# EasyEDA Pro project 407vet6_imu_car.eprj, board PCB1
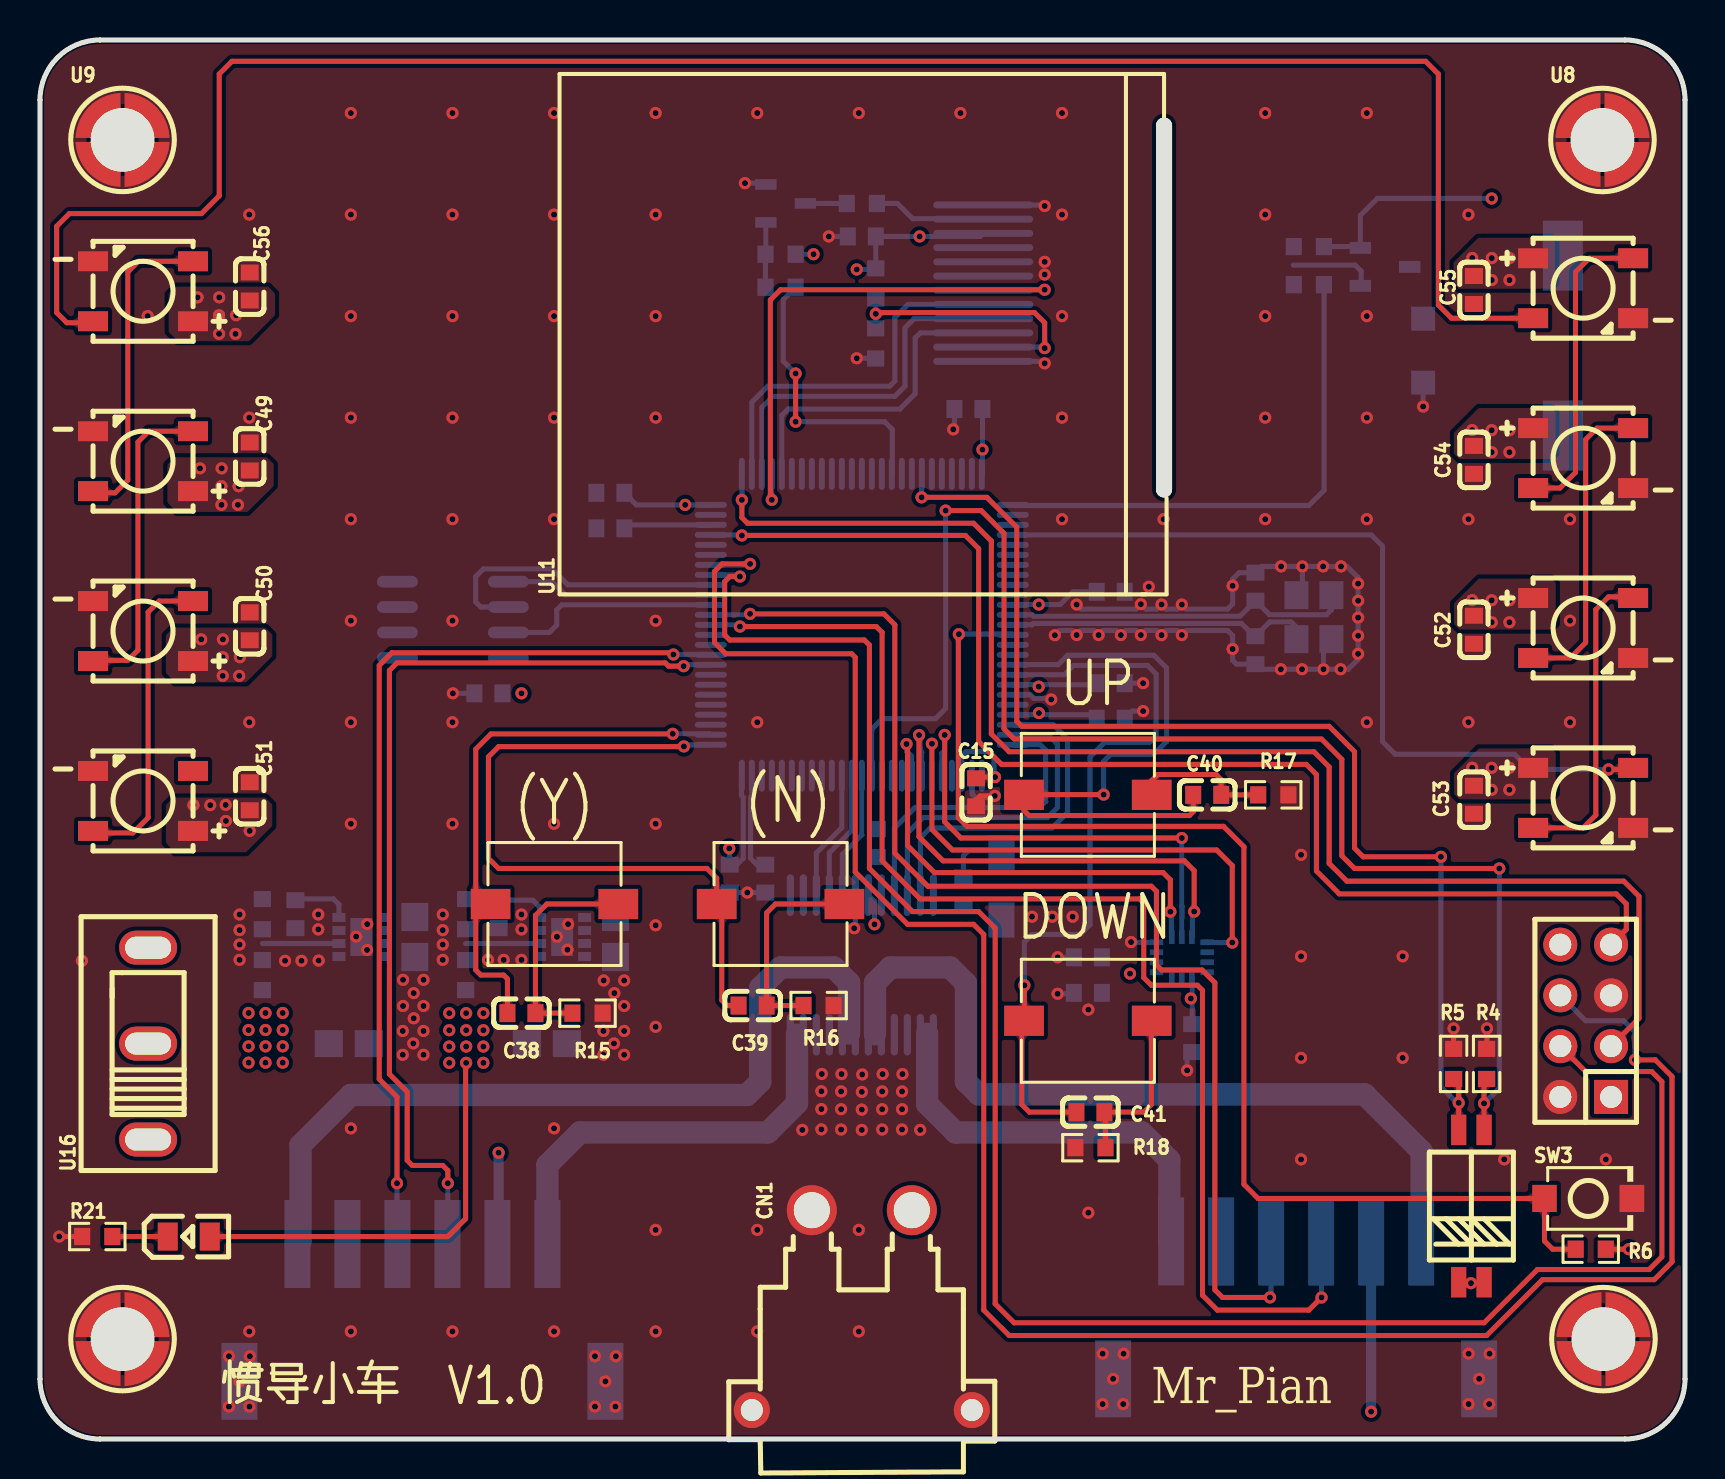
[diagram p2: board, top side]
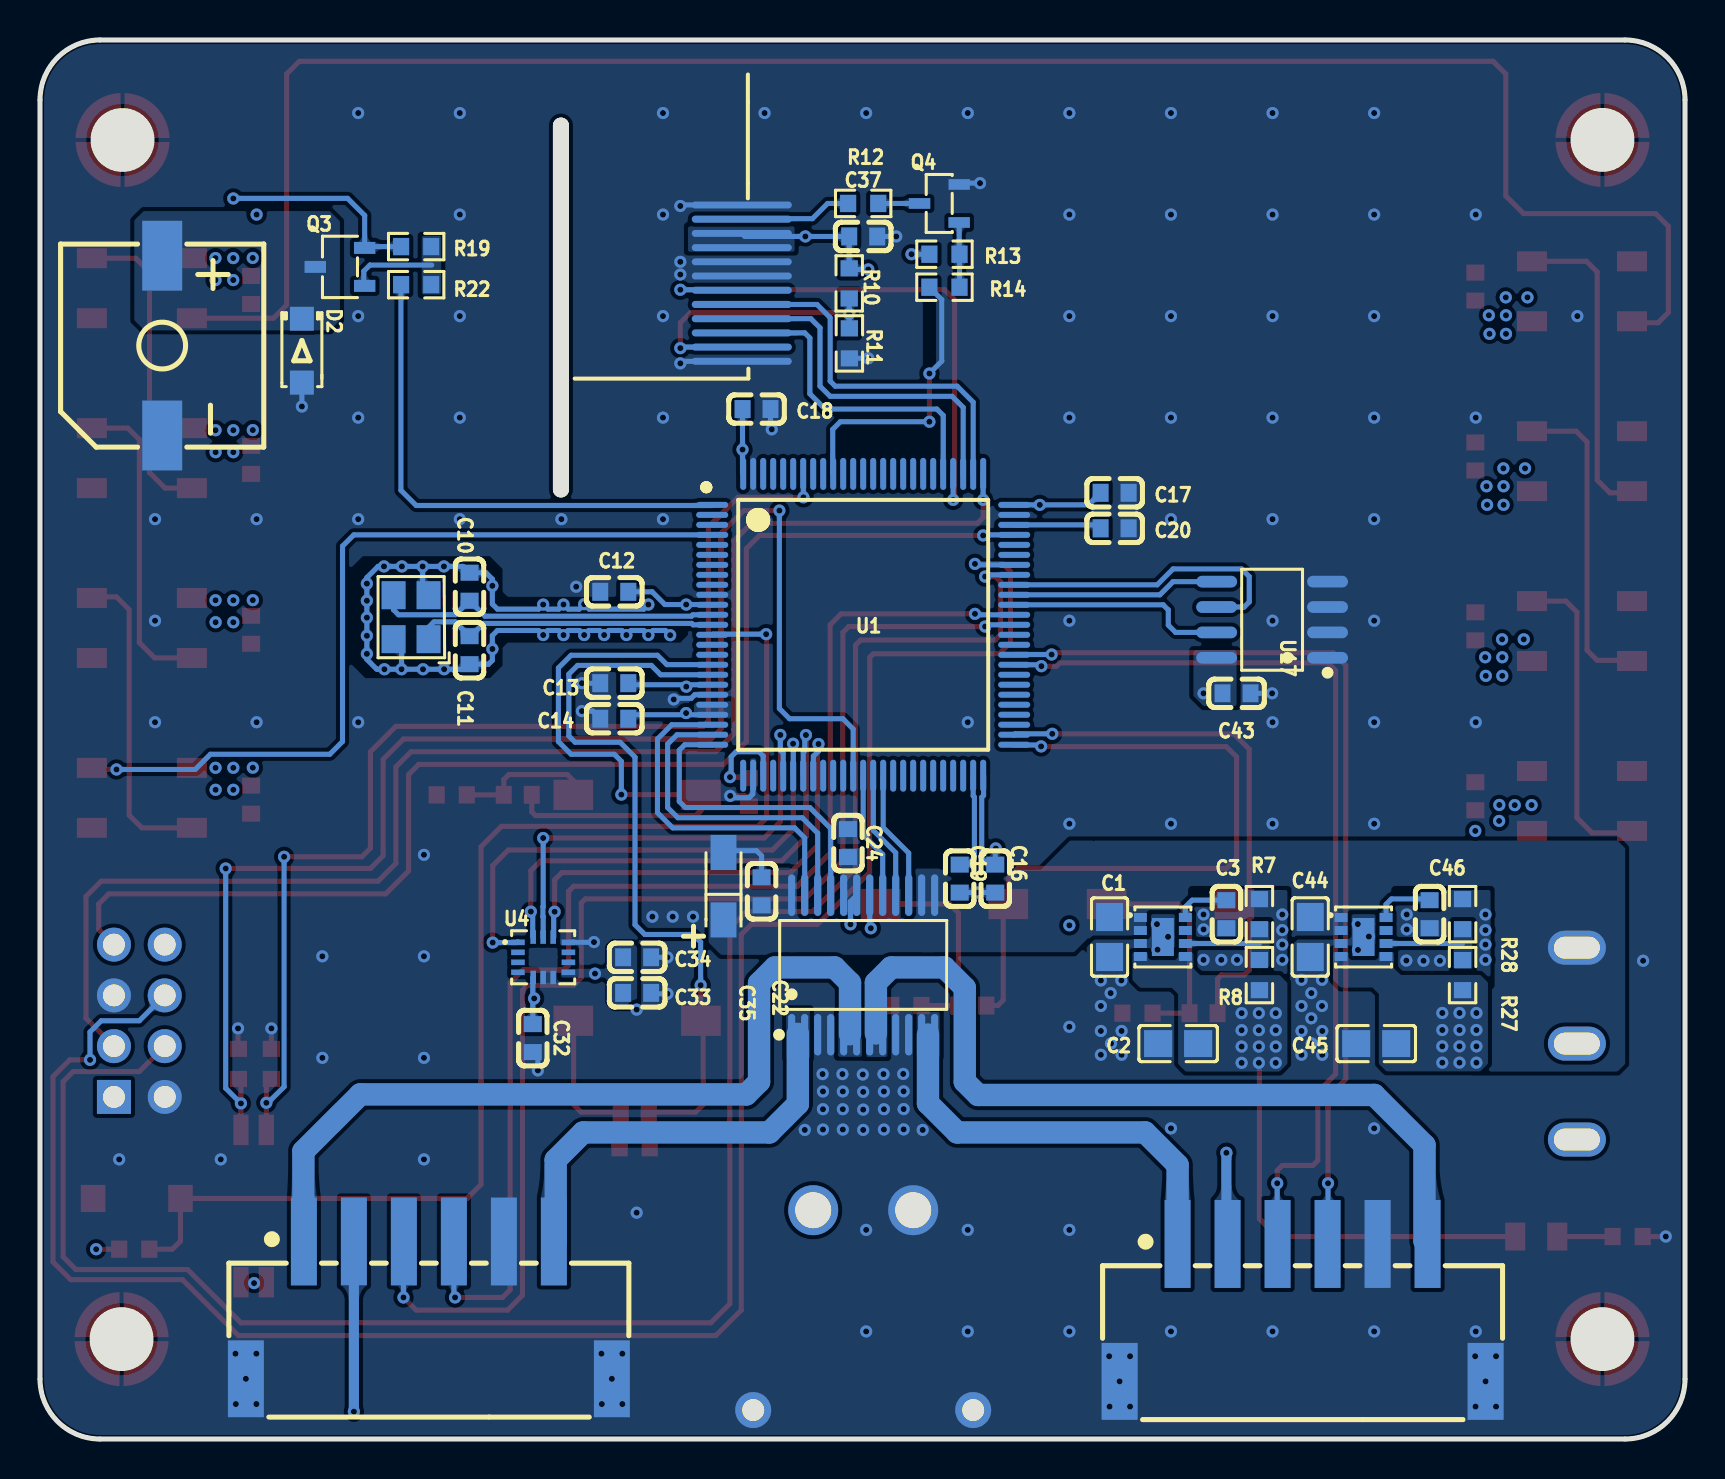
[diagram p3: board, bottom side, seen from below]

Outline 82.26 x 70 mm; copper layers: Top Layer, GND, PWR, Bottom Layer. Coordinates in mm from the lower left corner of the outline.
Outline path: 0,67 0,3 arc(0.88,0.88) 3,0 79.26,0 arc(81.38,0.88) 82.26,3 82.26,67 arc(81.38,69.12) 79.26,70 3,70 arc(0.88,69.12) 0,67
Stack: Top Layer 0.035mm 外层铜厚1oz / Dielectric1 0.2104mm 7628 RC49% 8.6mil / GND 0.0152mm 内层铜厚 / Dielectric2 1.065mm 1.1mm H/HOZ Copper / PWR 0.0152mm 内层铜厚 / Dielectric3 0.2104mm 7628 RC49% 8.6mil / Bottom Layer 0.035mm 外层铜厚1oz

## Design rules (mm)
template: 自定义配置
spacing copperThickness1oz (default): track to track 0.102, other pairs 0 to 0.3
spacing copperThickness2oz: track to track 0.203, other pairs 0.152 to 0.3
track width copperThickness1oz (default): min 0.127, default 0.254, max 2.54
track width copperThickness2oz: min 0.203, default 0.254, max 2.54
differential pair differentialPair (default): width min 0.127, default 0.254, max 2.54; gap min 0.152, default 0.152
via viaSize (default): diameter min 0.5, default 0.61, max 10; hole min 0.3, default 0.305, max 6.3
net GND uses innerPlane1

## Placement (name value [footprint] x y rotation side)
BUZZER1  2.7kHz  [BUZ-SMD_L9.6-W9.6-LS10.0-R]  76.14 54.71 90 bottom
C1  10uF  [C0805]  28.77 25.12 270 bottom
C2  22uF  [C0805]  25.34 19.78 180 bottom
C3  3.3nF  [C0603]  22.93 26.26 270 bottom
C10  20pF  [C0603]  60.78 42.64 270 bottom
C11  20pF  [C0603]  60.78 39.47 270 bottom
C12  100nF  [C0603]  53.54 42.39 180 bottom
C13  100nF  [C0603]  53.54 37.82 180 bottom
C14  100nF  [C0603]  53.54 36.04 180 bottom
C15  100nF  [C0603]  46.81 32.36 90 top
C16  100nF  [C0603]  34.49 28.04 90 bottom
C17  100nF  [C0603]  28.52 47.34 0 bottom
C18  100nF  [C0603]  46.43 51.53 0 bottom
C19  2.2uF  [C0603]  36.27 28.04 90 bottom
C20  2.2uF  [C0603]  28.52 45.56 0 bottom
C22  100nF  [C0603]  46.17 27.4 90 bottom
C24  100nF  [C0603]  41.86 29.82 90 bottom
C32  10nF  [C0603]  57.61 20.06 90 bottom
C33  2.2uF  [C0603]  52.4 22.32 0 bottom
C34  100nF  [C0603]  52.4 24.1 0 bottom
C35  10uF  [CAP-SMD_L3.2-W1.6-RD-C7171]  48.08 27.66 90 bottom
C37  100nF  [C0603]  41.09 60.17 180 bottom
C38  100nF  [C0603]  24.08 21.31 180 top
C39  100nF  [C0603]  35.63 21.69 180 top
C40  100nF  [C0603]  58.36 32.23 180 top
C41  100nF  [C0603]  52.52 16.35 180 top
C43  100nF  [C0603]  22.42 37.31 180 bottom
C44  10uF  [C0805]  18.74 25.12 270 bottom
C45  22uF  [C0805]  15.44 19.78 180 bottom
C46  3.3nF  [C0603]  12.77 26.26 270 bottom
C49  100nF  [C0603]  10.49 49.16 90 top
C50  100nF  [C0603]  10.49 40.66 90 top
C51  100nF  [C0603]  10.49 32.16 90 top
C52  100nF  [C0603]  71.7 40.49 270 top
C53  100nF  [C0603]  71.7 31.99 270 top
C54  100nF  [C0603]  71.7 48.99 270 top
C55  100nF  [C0603]  71.7 57.49 270 top
C56  100nF  [C0603]  10.49 57.66 90 top
CN1  XT30PW-M30.G.Y  [CONN-TH_XT30PW-M]  41.09 6.45 0 top
CN2  HCZZ0021-6  [CONN-SMD_HCZZ0021-6]  19.12 6.32 180 bottom
CN3  HCZZ0021-6  [CONN-SMD_HCZZ0021-6]  62.81 6.45 180 bottom
D2  1N4007 A7  [SOD-123FL_L2.8-W1.8-LS3.7-RD]  69.16 54.45 270 bottom
H1  PZ254V-12-8P  [HDR-TH_8P-P2.54-V-M-R2-C4-S2.54]  77.29 20.93 90 top
LED1  NCD0805R1  [LED0805-R-RD]  7.44 10.13 0 top
LED2  XL-5050RGBC-WS2812B  [LED-SMD_4P-L5.0-W5.0-BL_XL-5050RGBC]  77.16 32.08 270 top
LED3  XL-5050RGBC-WS2812B  [LED-SMD_4P-L5.0-W5.0-BL_XL-5050RGBC]  77.16 40.58 270 top
LED4  XL-5050RGBC-WS2812B  [LED-SMD_4P-L5.0-W5.0-BL_XL-5050RGBC]  77.16 49.08 270 top
LED5  XL-5050RGBC-WS2812B  [LED-SMD_4P-L5.0-W5.0-BL_XL-5050RGBC]  77.16 57.58 270 top
LED6  XL-5050RGBC-WS2812B  [LED-SMD_4P-L5.0-W5.0-BL_XL-5050RGBC]  5.15 57.43 90 top
LED7  XL-5050RGBC-WS2812B  [LED-SMD_4P-L5.0-W5.0-BL_XL-5050RGBC]  5.15 48.93 90 top
LED8  XL-5050RGBC-WS2812B  [LED-SMD_4P-L5.0-W5.0-BL_XL-5050RGBC]  5.15 40.43 90 top
LED9  XL-5050RGBC-WS2812B  [LED-SMD_4P-L5.0-W5.0-BL_XL-5050RGBC]  5.15 31.93 90 top
Q3  S8550  [SOT-23-3_L2.9-W1.6-P1.90-LS2.8-BR]  67.26 58.65 180 bottom
Q4  S8050  [SOT-23-3_L2.9-W1.3-P1.90-LS2.3-BR]  37.28 61.82 180 bottom
R4  10kΩ  [R0603]  72.33 18.77 90 top
R5  10kΩ  [R0603]  70.68 18.77 90 top
R6  10kΩ  [R0603]  77.54 9.5 0 top
R7  24kΩ  [R0603]  21.28 26.26 90 bottom
R8  75kΩ  [R0603]  21.28 23.21 90 bottom
R10  10kΩ  [R0603]  41.79 57.82 90 bottom
R11  0Ω  [R0603]  41.78 54.82 90 bottom
R12  10Ω  [R0603]  41.09 61.82 0 bottom
R13  10kΩ  [R0603]  37.03 59.28 180 bottom
R14  1kΩ  [R0603]  37.03 57.63 180 bottom
R15  10kΩ  [R0603]  27.38 21.31 180 top
R16  10kΩ  [R0603]  38.93 21.69 180 top
R17  10kΩ  [R0603]  61.67 32.23 180 top
R18  10kΩ  [R0603]  52.52 14.58 0 top
R19  10kΩ  [R0603]  63.45 59.66 180 bottom
R21  1kΩ  [R0603]  2.87 10.13 0 top
R22  1kΩ  [R0603]  63.45 57.76 180 bottom
R27  52.3kΩ  [R0603]  11.12 23.21 90 bottom
R28  10kΩ  [R0603]  11.12 26.26 90 bottom
SW2  DSHP02TSGER  [SW-SMD_DSHP02TSGER]  71.57 11.66 0 top
SW3  TS-1088-AR02016  [SW-SMD_L3.9-W3.0-P4.45]  77.42 12.04 0 top
U1  STM32F407VGT6  [LQFP-100_L14.0-W14.0-P0.50-LS16.0-BL]  41.09 40.74 270 bottom
U2  TPS82130SILR  [USIP-8_L3.0-W2.8-P0.65-TL-EP]  26.11 25.12 180 bottom
U3  TB6612FNG(O,C,8,EL  [SSOP-24_L8.4-W5.8-P0.65-LS7.8-BL]  41.09 23.72 180 bottom
U4  ICM-42688-P  [LGA-14_L3.0-W2.5-P0.50-TL]  57.09 24.1 180 bottom
U6  铜柱M3*5+6  [SMD_BD4.2-L4.7-W4.7-D3.0]  78.18 5 0 top
U7  铜柱M3*5+6  [SMD_BD4.2-L4.7-W4.7-D3.0]  4.13 5 0 top
U8  铜柱M3*5+6  [SMD_BD4.2-L4.7-W4.7-D3.0]  78.13 65 0 top
U9  铜柱M3*5+6  [SMD_BD4.2-L4.7-W4.7-D3.0]  4.13 65 0 top
U11  ST7789V-12PIN 1.3寸LCD  [ST7789V-12PIN]  56.33 42.26 90 top
U12  TS-1199A26050  [SW-SMD_L6.0-W6.0-LS6.6]  25.73 26.77 0 top
U13  TS-1199A26050  [SW-SMD_L6.0-W6.0-LS6.6]  37.03 26.77 0 top
U14  TS-1199A26050  [SW-SMD_L6.0-W6.0-LS6.6]  52.4 32.23 0 top
U15  TS-1199A26050  [SW-SMD_L6.0-W6.0-LS6.6]  52.4 20.93 0 top
U16  SS12D10G5  [SW-TH_SHOU-HAN_SS12D10G4]  5.41 19.78 90 top
U17  M24C02-RMN6TP  [SOIC-8_L4.9-W3.9-P1.27-LS6.0-BL]  20.65 40.99 90 bottom
U18  TPS82130SILR  [USIP-8_L3.0-W2.8-P0.65-TL-EP]  16.07 25.12 180 bottom
X1  8MHz  [OSC-SMD_4P-L3.2-W2.5-BL]  63.7 41.12 90 bottom

## Footprints (pads in the part's own frame, mm; a bottom-side part is the same pattern mirrored in y, then rotated)
BUZ-SMD_L9.6-W9.6-LS10.0-R
  rect 3.5x2 smd: 1(4.5,0) 2(-4.5,0)
C0603
  rect 0.8x0.9 smd: 1(-0.7,0) 2(0.7,0)
C0805
  rect 1.41x1.35 smd: 1(-1,0) 2(1,0)
CAP-SMD_L3.2-W1.6-RD-C7171
  rect 1.758x1.296 smd: 1(-1.687,0) 2(1.687,0)
CONN-SMD_HCZZ0021-6
  rect 1.3x4.4 smd: 1(-6.25,3.438) 2(-3.75,3.438) 3(-1.25,3.438) 4(1.25,3.438) 5(3.75,3.438) 6(6.25,3.438)
  rect 1.8x3.85 smd: 7(-9.15,-3.438) 8(9.15,-3.438)
CONN-TH_XT30PW-M
  round 2.5 hole 1.8: 1(-2.5,5) 2(2.5,5)
  round 1.8 hole 1.1: 3(5.5,-5) 4(-5.5,-5)
HDR-TH_8P-P2.54-V-M-R2-C4-S2.54
  rect 1.7x1.7 hole 1.1: 1(-3.81,-1.27)
  round 1.7 hole 1.1: 2(-3.81,1.27) 3(-1.27,-1.27) 4(-1.27,1.27) 5(1.27,-1.27) 6(1.27,1.27) 7(3.81,-1.27) 8(3.81,1.27)
LED0805-R-RD
  rect 1x1.399 smd: 1(1.05,0) 2(-1.05,0)
LED-SMD_4P-L5.0-W5.0-BL_XL-5050RGBC
  rect 1x1.5 smd: 1(-1.5,-2.5) 2(1.5,-2.5) 3(1.5,2.5) 4(-1.5,2.5)
LGA-14_L3.0-W2.5-P0.50-TL
  rect 0.675x0.28 smd: 1(-1.262,0.75) 2(-1.262,0.25) 3(-1.262,-0.25) 4(-1.262,-0.75) 8(1.262,-0.75) 9(1.262,-0.25) 10(1.262,0.25) 11(1.262,0.75)
  rect 0.28x0.675 smd: 5(-0.5,-1.012) 6(0,-1.012) 7(0.5,-1.012) 12(0.5,1.012) 13(0,1.012) 14(-0.5,1.012)
LQFP-100_L14.0-W14.0-P0.50-LS16.0-BL
  oval 0.3x1.6 smd: 1(-6,-7.55) 2(-5.5,-7.55) 3(-5,-7.55) 4(-4.5,-7.55) 5(-4,-7.55) 6(-3.5,-7.55) 7(-3,-7.55) 8(-2.5,-7.55) 9(-2,-7.55) 10(-1.5,-7.55) 11(-1,-7.55) 12(-0.5,-7.55) 13(0,-7.55) 14(0.5,-7.55) 15(1,-7.55) 16(1.5,-7.55) 17(2,-7.55) 18(2.5,-7.55) 19(3,-7.55) 20(3.5,-7.55) 21(4,-7.55) 22(4.5,-7.55) 23(5,-7.55) 24(5.5,-7.55) 25(6,-7.55) 51(6,7.55) 52(5.5,7.55) 53(5,7.55) 54(4.5,7.55) 55(4,7.55) 56(3.5,7.55) 57(3,7.55) 58(2.5,7.55) 59(2,7.55) 60(1.5,7.55) 61(1,7.55) 62(0.5,7.55) 63(0,7.55) 64(-0.5,7.55) 65(-1,7.55) 66(-1.5,7.55) 67(-2,7.55) 68(-2.5,7.55) 69(-3,7.55) 70(-3.5,7.55) 71(-4,7.55) 72(-4.5,7.55) 73(-5,7.55) 74(-5.5,7.55) 75(-6,7.55)
  oval 1.6x0.3 smd: 26(7.55,-6) 27(7.55,-5.5) 28(7.55,-5) 29(7.55,-4.5) 30(7.55,-4) 31(7.55,-3.5) 32(7.55,-3) 33(7.55,-2.5) 34(7.55,-2) 35(7.55,-1.5) 36(7.55,-1) 37(7.55,-0.5) 38(7.55,0) 39(7.55,0.5) 40(7.55,1) 41(7.55,1.5) 42(7.55,2) 43(7.55,2.5) 44(7.55,3) 45(7.55,3.5) 46(7.55,4) 47(7.55,4.5) 48(7.55,5) 49(7.55,5.5) 50(7.55,6) 76(-7.55,6) 77(-7.55,5.5) 78(-7.55,5) 79(-7.55,4.5) 80(-7.55,4) 81(-7.55,3.5) 82(-7.55,3) 83(-7.55,2.5) 84(-7.55,2) 85(-7.55,1.5) 86(-7.55,1) 87(-7.55,0.5) 88(-7.55,0) 89(-7.55,-0.5) 90(-7.55,-1) 91(-7.55,-1.5) 92(-7.55,-2) 93(-7.55,-2.5) 94(-7.55,-3) 95(-7.55,-3.5) 96(-7.55,-4) 97(-7.55,-4.5) 98(-7.55,-5) 99(-7.55,-5.5) 100(-7.55,-6)
OSC-SMD_4P-L3.2-W2.5-BL
  rect 1.4x1.2 smd: 1(-1.1,-0.875) 2(1.1,-0.875) 3(1.1,0.875) 4(-1.1,0.875)
R0603
  rect 0.806x0.864 smd: 1(-0.753,0) 2(0.753,0)
SMD_BD4.2-L4.7-W4.7-D3.0
  custom 2.25x2.25 smd: 1(-1.225,1.443) 1(-1.225,-1.442) 1(1.225,1.443) 1(1.225,-1.443)
SOD-123FL_L2.8-W1.8-LS3.7-RD
  rect 1.2x1.2 smd: 1(-1.6,0) 2(1.6,0)
SOIC-8_L4.9-W3.9-P1.27-LS6.0-BL
  oval 0.588x2.045 smd: 1(-1.905,-2.772) 2(-0.635,-2.772) 3(0.635,-2.772) 4(1.905,-2.772) 5(1.905,2.772) 6(0.635,2.772) 7(-0.635,2.772) 8(-1.905,2.772)
SOT-23-3_L2.9-W1.3-P1.90-LS2.3-BR
  rect 1.07x0.532 smd: 1(0.99,-0.95) 2(0.99,0.95) 3(-0.99,0)
SOT-23-3_L2.9-W1.6-P1.90-LS2.8-BR
  rect 1.07x0.6 smd: 1(1.235,-0.95) 2(1.235,0.95) 3(-1.235,0)
SSOP-24_L8.4-W5.8-P0.65-LS7.8-BL
  oval 0.364x2.082 smd: 1(-3.575,-3.491) 2(-2.925,-3.491) 3(-2.275,-3.491) 4(-1.625,-3.491) 5(-0.975,-3.491) 6(-0.325,-3.491) 7(0.325,-3.491) 8(0.975,-3.491) 9(1.625,-3.491) 10(2.275,-3.491) 11(2.925,-3.491) 12(3.575,-3.491) 13(3.575,3.491) 14(2.925,3.491) 15(2.275,3.491) 16(1.625,3.491) 17(0.975,3.491) 18(0.325,3.491) 19(-0.325,3.491) 20(-0.975,3.491) 21(-1.625,3.491) 22(-2.275,3.491) 23(-2.925,3.491) 24(-3.575,3.491)
ST7789V-12PIN
  oval 19x0.8 hole 19x0.8: (14.351,0.127)
  custom 0.35x4.999 smd far side: 1(19.482,9.169) 2(18.77,9.169) 3(18.059,9.169) 4(17.348,9.169) 5(16.637,9.169) 6(15.926,9.169) 7(15.214,9.169) 8(14.504,9.169) 9(13.792,9.169) 10(13.081,9.169) 11(12.37,9.169) 12(11.659,9.169)
SW-SMD_DSHP02TSGER
  rect 0.762x1.524 smd: 1(-0.635,-3.81) 2(0.635,-3.81) 3(0.635,3.81) 4(-0.635,3.81)
SW-SMD_L3.9-W3.0-P4.45
  rect 1.23x1.36 smd: 1(-2.185,0) 2(2.185,0)
SW-SMD_L6.0-W6.0-LS6.6
  rect 1.985x1.512 smd: 1(-3.192,0) 2(3.192,0)
SW-TH_SHOU-HAN_SS12D10G4
  oval 1.7x2.9 hole 1.1x2.3: 1(-4.8,0) 2(0,0) 3(4.8,0)
USIP-8_L3.0-W2.8-P0.65-TL-EP
  rect 0.65x0.45 smd: 1(-1.125,0.975) 2(-1.125,0.325) 3(-1.125,-0.325) 4(-1.125,-0.975) 5(1.125,-0.975) 6(1.125,-0.325) 7(1.125,0.325) 8(1.125,0.975)
  rect 1.1x1.9 smd: 9(0,0)

## Nets
As in the schematic.

Pads without a net: H1 8; LED9 2; U1 2 3 5 6 7 8 9 15 16 26 29 34 35 36 41 42 43 44 45 46 47 48 53 54 55 56 57 58 61 62 70 71 81 82 83 84 85 86 87 88 89 90 92 93 95 96 97 98; U2 7; U4 2 3 4 9 10; U16 1; U18 7

## Via types
v1: diameter 0.61, hole 0.305, Top Layer to Bottom Layer, 347 vias

## Routing (per net, layer and track width the routed paths; a pad name or vN(x,y) marks a point on that pad's centre or on a via; arc(x,y) is an arc through that point)
5V: length 239.1
  PWR w0.762: v1(66.56,1.37) 55.83,1.37 55.32,0.86 48.71,0.86 48.33,1.24 48.33,3.4 47.95,3.78 46.68,3.78 46.3,4.16 46.3,12.67 44.65,14.32 v1(22.93,14.32) 11.88,14.32 10.36,15.85 10.36,18.76 v1(10.43,18.83)
  PWR w1.27: v1(72.59,33.58) v1(72.59,40.87) v1(72.59,41.97) 72.59,41.97 v1(72.59,57.99) v1(72.59,59.09) 72.59,59.09 v1(72.59,62.07) 72.59,65.88 70.94,67.54 10.49,67.54 8.96,66.01 v1(8.96,57.12) 8.96,29.05 11.16,26.85 11.16,21.43 v1(11.28,21.32) v1(11.28,20.46)
  Bottom Layer w0.254: 72.59,62.07 66.87,62.07 66.02,61.22 Q3.2 65.95,59.66 R19.1
  Bottom Layer w0.508: CN3.2 v1(66.56,1.37) ; v1(22.93,14.32) 22.93,9.82 CN2.2
  vias: v1(7.67,31.72) v1(7.88,57.12) v1(8,48.57) v1(8.06,40.01) v1(8.51,31.72) v1(8.95,56.23) v1(8.95,55.3) v1(9.08,48.57) v1(9.07,47.67) v1(9.07,46.74) v1(9.15,40.01) v1(9.14,39.12) v1(9.14,38.19) v1(9.29,31.73) v1(9.3,30.93) v1(9.81,56.23) v1(9.78,55.3) v1(9.9,46.74) v1(9.93,47.67) v1(9.99,39.12) v1(9.96,38.19) v1(10.49,30.43) v1(10.43,21.32) v1(10.43,20.46) v1(10.43,19.65) v1(11.28,19.65) v1(11.28,18.83) v1(12.14,21.32) v1(12.14,20.46) v1(12.14,19.65) v1(12.14,18.83) v1(71.61,50.48) v1(71.61,41.97) v1(71.61,33.59) v1(71.62,59.09) v1(72.59,50.47) v1(72.59,49.37) v1(72.59,32.48) v1(73.48,59.09) v1(73.48,57.99) v1(73.48,50.47) v1(73.47,49.37) v1(73.48,41.97) v1(73.47,40.87) v1(73.48,33.58) v1(73.47,32.48)
GND: length 75.8
  Top Layer w0.254: C15.1 46.81,31.98 47.01,32.18 v1(47.74,32.18) ; v1(70.68,20.55) R5.2 ; v1(0.96,10.13) R21.1 ; R4.2 72.35,19.54 v1(72.35,20.55)
  Bottom Layer w0.254: v1(40.84,54.07) 41.77,54.07 R11.1 ; v1(50.24,61.69) 50.19,61.74 U11.1 ; v1(63.12,43.66) v1(62.06,43.66) 61.09,43.66 C10.1 59.95,43.34 59.64,43.02 v1(59.64,42.69) 59.64,41.78 59.38,41.52 57.32,41.52 v1(57.09,41.75) 56.87,41.52 56.31,41.52 v1(56.08,41.75) 55.85,41.52 55.29,41.52 v1(55.05,41.77) 54.8,41.52 52.06,41.52 v1(51.83,41.75) ; v1(63.12,43.66) 63.12,42.52 X1.2 ; v1(63.12,43.66) v1(64.16,43.66) 65.35,43.66 65.91,43.1 v1(65.91,41.94) v1(65.91,41.1) v1(65.91,40.19) 65.91,39.01 65.41,38.51 v1(65.03,38.51) v1(64.18,38.51) ; 46.58,33.22 46.61,33.19 46.61,32.27 46.79,32.09 47.75,32.09 ; U3.18 40.77,25.61 v1(40.71,25.56) ; v1(50.88,24.1) C34.1 ; C33.1 51.65,22.28 v1(50.88,22.28) ; v1(64.18,38.51) v1(63.1,38.51) v1(62.05,38.51) 61.03,38.51 C11.2 59.83,38.77 59.64,38.96 v1(59.64,39.53) 59.64,40.2 59.38,40.45 57.32,40.45 v1(57.09,40.23) 56.87,40.45 56.31,40.45 v1(56.08,40.22) 55.85,40.45 55.27,40.45 v1(55.05,40.23) 54.82,40.45 54.27,40.45 v1(54.05,40.23) 53.82,40.45 53.16,40.45 v1(52.93,40.23) 52.71,40.45 52.06,40.45 v1(51.83,40.23) 51.61,40.45 50.98,40.45 v1(50.74,40.22) ; v1(64.18,38.51) 64.18,39.62 X1.4 ; v1(57.36,18.44) 57.36,19.11 C32.1 ; D2.2 v1(69.16,51.66) ; C43.2 v1(20.65,37.31) ; v1(45.67,50.52) 45.73,50.58 C18.1 ; v1(55.16,36.42) 54.62,36.42 C14.1 ; v1(50.24,53.82) 50.14,53.92 U11.12 ; U4.11 54.57,24.85 v1(54.55,24.86) ; C19.1 35.37,27.34 v1(35.37,27.34) 34.49,27.34 C16.1 ; C35.2 47.99,29.44 46.43,29.44 46.17,29.18 C22.2 ; v1(35.25,62.84) 36.23,62.84 Q4.2 ; v1(39.44,60.17) 40.39,60.17 ; v1(50.57,37) 50.51,37.06 49.7,37.06 49.52,37.24 U1.20 ; C13.1 55.16,37.82
  vias: v1(2.09,23.93) v1(5.38,56.18) v1(9.45,4.14) v1(9.45,1.62) v1(9.98,26.24) v1(9.98,25.46) v1(9.98,24.74) v1(9.98,23.97) v1(9.97,2.88) v1(10.46,61.26) v1(10.46,51.1) v1(10.46,35.86) v1(10.46,5.38) v1(10.49,4.14) v1(10.47,1.62) v1(12.25,23.93) v1(13.08,23.93) v1(13.91,26.24) v1(13.91,25.5) v1(13.93,23.94) v1(15.54,66.34) v1(15.54,61.26) v1(15.54,56.18) v1(15.54,51.1) v1(15.54,46.02) v1(15.54,40.94) v1(15.54,35.86) v1(15.54,30.78) v1(15.54,15.54) v1(15.54,5.38) v1(15.81,25.14) v1(16.36,25.76) v1(16.35,24.47) v1(18.15,22.98) v1(18.15,21.67) v1(18.14,20.42) v1(18.14,19.23) v1(18.69,22.31) v1(18.69,21.05) v1(18.67,19.79) v1(19.18,22.98) v1(19.18,21.67) v1(19.18,20.42) v1(19.18,19.23) v1(20.14,26.24) v1(20.14,25.46) v1(20.14,24.74) v1(20.14,23.97) v1(20.62,66.34) v1(20.62,61.26) v1(20.62,56.18) v1(20.62,51.1) v1(20.62,46.02) v1(20.62,40.94) v1(20.62,35.86) v1(20.62,30.78) v1(20.62,5.38) v1(22.4,23.97) v1(23.19,23.97) v1(24.08,26.24) v1(24.08,25.5) v1(24.08,23.97) v1(25.7,66.34) v1(25.7,61.26) v1(25.7,56.18) v1(25.7,51.1) v1(25.7,46.02) v1(25.7,30.78) v1(25.7,15.54) v1(25.7,5.38) v1(25.85,25.13) v1(26.4,25.76) v1(26.37,24.48) v1(27.75,4.14) v1(27.75,1.62) v1(28.19,22.94) v1(28.17,20.42) v1(28.17,19.23) v1(28.27,2.88) v1(28.7,19.79) v1(28.72,22.31) v1(28.79,4.14) v1(28.77,1.62) v1(29.21,22.94) v1(29.21,21.67) v1(29.21,20.42) v1(29.21,19.23) v1(30.78,66.34) v1(30.78,61.26) v1(30.78,56.18) v1(30.78,51.1) v1(30.78,40.94) v1(30.78,30.78) v1(30.78,25.7) v1(30.78,20.62) v1(30.78,10.46) v1(30.78,5.38) v1(35.86,66.34) v1(35.86,35.86) v1(35.86,10.46) v1(35.86,5.38) v1(38.12,15.47) v1(39.09,18.27) v1(39.07,17.4) v1(39.07,16.51) v1(39.07,15.49) v1(40.08,18.26) v1(40.06,17.39) v1(40.06,16.5) v1(40.06,15.49) v1(40.94,66.34) v1(40.94,10.46) v1(40.94,5.38) v1(41.11,18.24) v1(41.09,17.37) v1(41.09,16.48) v1(41.09,15.47) v1(42.11,17.39) v1(42.11,16.5) v1(42.11,15.49) v1(42.13,18.26) v1(43.1,17.39) v1(43.1,16.5) v1(43.1,15.49) v1(43.12,18.26) v1(44.01,15.47) v1(46.02,66.34) v1(49.6,26.13) v1(50.24,58.9) v1(50.24,58.26) v1(50.62,26.13) v1(51.1,66.34) v1(51.1,61.26) v1(51.1,56.18) v1(51.1,51.1) v1(51.1,46.02) v1(51.63,26.13) v1(52.42,21.48) v1(52.42,11.32) v1(53.14,4.27) v1(53.14,1.75) v1(53.66,3.01) v1(54.18,4.27) v1(54.16,1.75) v1(55.16,37.82) v1(55.44,42.64) v1(56.18,46.02) v1(61.26,66.34) v1(61.26,61.26) v1(61.26,56.18) v1(61.26,51.1) v1(61.26,46.02) v1(63.06,29.23) v1(63.06,24.15) v1(63.06,19.07) v1(63.06,13.99) v1(65.05,43.66) v1(65.91,42.8) v1(65.91,39.29) v1(66.34,66.34) v1(66.34,56.18) v1(66.34,51.1) v1(66.34,46.02) v1(66.34,35.86) v1(68.14,24.15) v1(68.14,19.07) v1(71.42,61.26) v1(71.42,46.02) v1(71.42,35.86) v1(71.44,4.27) v1(71.44,1.75) v1(71.96,3.01) v1(72.48,4.27) v1(72.46,1.75) v1(73.22,13.99) v1(76.5,46.02) v1(76.5,40.94) v1(76.5,35.86) v1(78.3,13.99)
VDD: length 67.7
  Top Layer w0.254: R6.2 v1(79.45,9.5) ; SW2.1 70.98,7.8 v1(71.55,7.8) 72.16,7.8 SW2.2 ; v1(21.31,18.82) 21.28,18.79 21.28,11.02 20.39,10.13 LED1.1 ; v1(47.75,33.12) 46.87,33.12 C15.2
  Bottom Layer w0.254: v1(40.84,58.52) 41.74,58.52 R10.2 ; U4.5 57.61,23.07 C32.2 ; C17.2 29.82,46.74 v1(32.26,46.74) U1.75 ; C14.2 52.64,36.24 U1.22 ; 41.79,58.58 C37.1 v1(43.98,60.17) 47.01,60.17 U11.3 ; v1(34.46,29.55) 34.49,29.53 C16.2 34.85,28.74 35.17,29.05 35.17,32.11 35.07,32.2 35.07,33.17 U1.50 ; U1.11 48.66,41.75 v1(49.94,41.75) 51.01,41.75 51.65,42.39 C12.2 ; v1(38.68,59.28) R13.1 ; U3.19 41.73,26.9 v1(41.73,25.75) ; C13.2 52.76,37.74 U1.19 ; U1.100 47.13,48.32 v1(47.13,49.51) C18.2 ; U1.28 46.09,34.18 46.3,34.39 47.44,34.39 47.7,34.13 47.7,33.18 v1(47.75,33.12)
  vias: v1(20.46,21.31) v1(20.46,20.45) v1(20.46,19.64) v1(20.46,18.82) v1(21.31,21.31) v1(21.31,20.45) v1(21.31,19.64) v1(22.17,21.31) v1(22.17,20.45) v1(22.17,19.64) v1(22.17,18.82) v1(24.08,37.31) v1(49.94,37.64) v1(49.95,36.32) v1(54.5,23.29) v1(57.55,22.04)
8M_IN: length 15.5
  Bottom Layer w0.254: U1.13 49.6,40.74 49.67,40.81 60.07,40.81 60.71,40.17 C11.1 61.49,40.88 62.56,40.88 62.82,40.62 X1.1
8M_OUT: length 17.4
  Bottom Layer w0.254: U1.12 49.61,41.24 49.68,41.17 60,41.17 C10.2 61.48,41.25 62.1,41.25 62.11,41.24 64.33,41.24 64.57,41.49 X1.3
AIN1: length 15.8
  Bottom Layer w0.254: U3.21 42.72,30.55 43.76,31.59 49.98,31.59 50.29,31.9 50.29,34.46 50.01,34.74 U1.25
AIN2: length 16.7
  Bottom Layer w0.254: U1.24 50.4,35.24 50.87,34.77 50.87,31.59 50.36,31.09 44.14,31.09 43.37,30.31 U3.22
AO1: length 21
  Bottom Layer w1.117: 44.36,20.27 44.36,16.76 45.79,15.34 55.1,15.34 56.47,13.97 56.47,9.92 56.6,9.78
AO2: length 40.9
  Bottom Layer w1.117: 41.75,20.25 41.75,22.82 42.52,23.59 45.51,23.59 46.3,22.8 46.3,17.88 46.93,17.24 66.24,17.24 69.08,14.4 69.08,10.4 69.07,10.38
BIN1: length 6.4
  Bottom Layer w0.254: U1.38 41.09,30.23 40.12,29.25 U3.17
BIN2: length 6.4
  Bottom Layer w0.254: U1.39 40.58,33.18 40.58,30.45 39.47,29.33 U3.16
BLK: length 14.5
  Top Layer w0.254: v1(37.78,53.31) v1(37.78,50.9)
  Bottom Layer w0.254: U1.91 42.62,48.31 42.62,50.52 42.24,50.9 v1(37.78,50.9) ; R14.1 37.16,57.01 37.16,53.93 v1(37.78,53.31)
BO1: length 21.2
  Bottom Layer w1.117: 37.85,20.24 37.85,16.8 36.39,15.34 27,15.34 25.37,13.71 CN2.1
BO2: length 41.7
  Bottom Layer w1.117: CN2.6 13.03,9.91 13.03,14.7 15.54,17.22 35.35,17.22 36.01,17.88 36.01,22.58 37.03,23.59 39.7,23.59 40.46,22.83 40.46,20.29
BOOT0: length 58.5
  Top Layer w0.254: v1(70.05,29.13) 66.16,29.13 65.73,29.56 65.73,34.39 64.46,35.66 49.09,35.66 48.84,35.91 48.84,45.62 47.35,47.12 v1(44.08,47.12) ; R5.1 70.94,17.76 v1(70.94,16.82) SW2.4
  Bottom Layer w0.254: v1(70.05,29.13) 70.05,17.62 70.85,16.82 v1(70.94,16.82) ; v1(44.08,47.12) 44.08,48.28 U1.94
BOOT1: length 74.7
  Top Layer w0.254: SW2.3 v1(72.21,16.79) 72.21,17.89 R4.1 ; v1(45.28,46.45) 47.06,46.45 48.2,45.31 48.2,35.53 48.71,35.02 64.08,35.02 65.1,34.01 65.1,29.18 65.73,28.55 v1(72.97,28.55)
  Bottom Layer w0.254: v1(72.21,16.79) 72.97,17.55 v1(72.97,28.55) ; U1.37 41.59,35.52 42.11,36.04 44.78,36.04 45.28,36.55 v1(45.28,46.45)
BUZZ: length 26.2
  Bottom Layer w0.254: R22.1 64.21,57.75 64.21,47.47 63.45,46.71 48.67,46.71 U1.1
CLK: length 23.6
  Top Layer w0.254: v1(45.24,35.23) 45.24,30.88 46.05,30.07 v1(57.09,30.07)
  Bottom Layer w0.254: v1(57.09,30.07) 57.09,26.64 57.11,26.63 57.11,26.14 57.09,26.13 U4.13 ; U1.30 45.09,34.31 45.24,34.45 v1(45.24,35.23)
CS: length 23.6
  Top Layer w0.254: v1(56.52,26.38) 56.52,27.98 56.16,28.34 44.73,28.34 43.38,29.69 43.38,34.72 v1(43.33,34.77)
  Bottom Layer w0.254: v1(43.33,34.77) 43.33,34.42 43.58,34.16 43.58,33.18 ; 56.57,25.09 56.57,26.34 v1(56.52,26.38)
DC: length 28.3
  Top Layer w0.254: v1(36.59,46.99) 36.52,47.06 36.52,56.99 37.03,57.5 v1(50.24,57.5)
  Bottom Layer w0.254: U1.79 v1(36.59,46.99) ; v1(50.24,57.5) 47.19,57.5 U11.7
E1A: length 62.8
  Top Layer w0.254: v1(61.5,7.08) 59.13,7.08 58.75,7.46 58.75,22.83 58.11,23.47 56.08,23.47 55.83,23.72 55.83,27.4 55.57,27.66 44.39,27.66 42.74,29.31 42.74,40.74 42.2,41.29 v1(35.51,41.29)
  Bottom Layer w0.254: CN3.4 61.56,7.14 v1(61.5,7.08) ; U1.64 35.46,41.24 v1(35.51,41.29)
E1B: length 65.6
  Top Layer w0.254: v1(64.08,7.08) 63.45,6.45 58.87,6.45 58.13,7.19 58.13,22.45 57.87,22.7 55.57,22.7 55.19,23.09 55.19,26.82 54.99,27.02 44.01,27.02 42.11,28.93 42.11,40.36 41.81,40.65 v1(35,40.65)
  Bottom Layer w0.254: CN3.3 64.08,9.87 v1(64.08,7.08) ; v1(35,40.65) 34.91,40.74 U1.63
E2A: length 46.2
  Top Layer w0.254: v1(17.85,12.8) 17.85,17.12 16.96,18.01 16.96,38.71 17.6,39.34 31.58,39.34 v1(31.67,39.25)
  Bottom Layer w0.254: U1.60 33.53,39.25 v1(31.67,39.25) ; CN2.4 17.85,9.78 v1(17.85,12.8)
E2B: length 47.1
  Top Layer w0.254: v1(32.18,38.67) 31.43,38.67 31.26,38.83 17.85,38.83 17.47,38.45 17.47,18.26 18.36,17.37 18.36,13.94 18.61,13.69 20.14,13.69 20.39,13.43 v1(20.39,12.8)
  Bottom Layer w0.254: v1(32.18,38.67) 32.25,38.74 U1.59 ; v1(20.39,12.8) 20.39,9.78 CN2.3
KEY1: length 27.6
  Top Layer w0.254: C38.2 23.38,23.02 23.19,23.21 22.04,23.21 21.79,23.47 21.79,26.26 22.42,26.9 ; 22.42,26.9 22.53,26.9 U12.1 ; 22.42,26.9 22.04,26.9 21.79,27.15 21.79,34.52 22.55,35.28 31.63,35.28 v1(31.64,35.28)
  Bottom Layer w0.254: 33.56,35.22 33.5,35.28 v1(31.64,35.28)
KEY2: length 35.3
  Top Layer w0.254: C39.2 34.36,21.69 34.09,21.96 34.09,26.77 ; v1(32.2,34.65) 32.19,34.64 22.93,34.64 22.42,34.13 22.42,29.05 22.93,28.55 33.35,28.55 33.84,28.06 U13.1
  Bottom Layer w0.254: v1(32.2,34.65) 32.27,34.72 33.56,34.72
KEY3: length 31.3
  Top Layer w0.254: C40.2 57.67,31.38 57.48,31.19 49.46,31.19 49.2,31.45 U14.1 49.22,32.24 v1(53.19,32.24)
  Bottom Layer w0.254: v1(53.19,32.24) 53.19,33.91 53.54,34.26 55.7,34.26 56.33,34.9 56.33,38.58 55.7,39.21 51.38,39.21 50.91,38.75 48.65,38.75 U1.17
KEY4: length 37.5
  Top Layer w0.254: C41.2 49.48,16.35 49.09,16.74 49.09,20.82 U15.1 49.22,20.94 v1(49.22,22.7)
  Bottom Layer w0.254: U1.18 51.22,38.24 51.69,38.71 55.37,38.71 55.81,38.27 55.81,35.18 55.5,34.86 53.25,34.86 52.5,34.12 52.5,25.73 52.02,25.24 49.6,25.24 49.22,24.86 v1(49.22,22.7)
LCD_CS: length 19
  Bottom Layer w0.254: U11.8 43.4,56.77 42.74,56.11 42.74,52.93 42.49,52.68 36.39,52.68 35.59,51.88 U1.77
LCD_MOSI: length 16.3
  Bottom Layer w0.254: U11.10 44.01,55.34 43.76,55.09 43.76,52.3 43,51.53 37.41,51.53 37.09,51.22 37.09,48.29
LCD_SCK: length 17.9
  Bottom Layer w0.254: U11.9 43.71,56.05 43.25,55.6 43.25,52.68 42.74,52.17 36.65,52.17 36.09,51.61 U1.78
MCU_RX: length 105.9
  Top Layer w0.254: v1(79.75,18.97) 80.77,18.97 81.61,18.13 81.61,8.86 80.72,7.97 75.13,7.97 72.33,5.18 48.46,5.18 47.19,6.45 47.19,25.24 46.68,25.75 43.38,25.75 40.76,28.37 40.76,39.11 40.58,39.29 34.29,39.29 33.73,39.85 33.73,43.41 34.11,43.79 v1(35.51,43.79)
  Bottom Layer w0.254: v1(79.75,18.97) 79.75,20.37 79.19,20.93 77.29,20.93 H1.6 ; v1(35.51,43.79) 35.46,43.74 U1.69
MCU_TX: length 99.6
  Top Layer w0.254: 76.02,19.66 77.29,18.39 80.59,18.39 81.1,17.88 81.1,9.12 80.46,8.48 74.87,8.48 72.21,5.81 48.71,5.81 47.76,6.77 47.76,25.56 46.93,26.39 43.63,26.39 41.47,28.55 41.47,39.72 41.22,39.98 34.49,39.98 34.23,40.23 34.23,42.9 34.49,43.15 v1(35,43.15)
  Bottom Layer w0.254: U1.68 34.91,43.24 v1(35,43.15)
MISO: length 26.8
  Top Layer w0.254: v1(44.6,34.79) 44.6,30.5 45.63,29.47 58.84,29.47 59.62,28.69 v1(59.62,24.84)
  Bottom Layer w0.254: U1.31 44.58,33.2 44.58,34.78 v1(44.6,34.79) ; v1(59.62,24.84) 58.4,24.84 58.37,24.88
MOSI: length 25.1
  Top Layer w0.254: v1(57.71,26.39) 57.71,28.44 57.22,28.93 45.16,28.93 43.95,30.13 43.95,34.98 43.89,35.04 43.89,35.16 v1(43.96,35.22)
  Bottom Layer w0.254: U1.32 44.09,34.36 44.02,34.44 44.02,34.54 44.01,34.55 44.01,35.03 43.96,35.09 v1(43.96,35.22) ; 57.62,25.12 57.62,26.29 v1(57.71,26.39)
PWMA: length 17.5
  Bottom Layer w0.254: U3.23 44.02,30.07 44.52,30.58 50.62,30.58 51.38,31.34 51.38,35.02 50.67,35.74 U1.23
PWMB: length 6.5
  Bottom Layer w0.254: U1.40 40.09,30.59 38.82,29.32 U3.15
RST: length 63
  Top Layer w0.254: v1(45.95,40.27) 45.92,40.24 45.92,31.09 46.35,30.65 59.18,30.65 60.2,29.63 60.2,12.74 60.9,12.04 SW3.1 75.23,9.9 75.64,9.5 76.53,9.5 76.79,9.24
  Bottom Layer w0.254: v1(45.95,40.27) 48.61,40.27 U1.14
SCL: length 15.2
  Bottom Layer w0.254: U1.67 26.39,42.74 25.6,43.53 22.17,43.53 21.79,43.15 21.79,41.88 22.04,41.63 U17.6
SDA: length 10.4
  Bottom Layer w0.254: U1.66 26.26,42.24 25.6,42.9 U17.5
SWCLK: length 71.5
  Top Layer w0.254: 78.56,19.66 79.95,21.05 79.95,27.15 79.19,27.91 65.35,27.91 64.46,28.8 64.46,33.63 63.7,34.39 48.46,34.39 47.57,35.28 47.57,44.93 46.68,45.82 35.38,45.82 35.1,46.1 v1(35.1,46.99)
  Bottom Layer w0.254: U1.76 35.1,48.29 v1(35.1,46.99)
SWDIO: length 64.3
  Top Layer w0.254: 78.56,24.74 79.32,25.5 79.32,26.77 78.81,27.28 64.97,27.28 63.83,28.42 63.83,33.25 63.32,33.75 48.08,33.75 46.93,34.9 46.93,44.55 46.27,45.21 v1(35.1,45.21)
  Bottom Layer w0.254: v1(35.1,45.21) 35.07,45.24 U1.72
VCAP_1: length 4.6
  Bottom Layer w0.254: U1.49 35.59,32.18 35.53,32.12 35.53,29.05 35.85,28.74 35.89,28.74
VCAP_2: length 4.4
  Bottom Layer w0.254: U1.73 29.39,45.74 C20.2
WC#: length 11.1
  Bottom Layer w0.254: U1.65 26.09,41.74 25.84,41.48 25.84,40.72 25.47,40.36 U17.7
WS2812B: length 41.6
  Top Layer w0.254: LED2.4 79.58,33.5 v1(78.43,33.5)
  Bottom Layer w0.254: U1.4 66.56,45.24 67.13,44.68 67.13,34.9 67.76,34.26 73.73,34.26 74.49,33.5 v1(78.43,33.5)
$1N2697: length 2.7
  Bottom Layer w0.254: C3.1 24.64,26.96 24.98,26.62 U2.8
$1N2951: length 3.7
  Bottom Layer w0.254: U2.6 21.28,24.79
$1N16688: length 3.2
  Bottom Layer w0.254: Q4.1 36.29,59.3 R13.2 R14.2
$1N16689: length 5.6
  Bottom Layer w0.254: U11.2 47.14,61.06 43.63,61.06 42.87,61.82 R12.2
$1N16699: length 2.1
  Bottom Layer w0.254: Q4.3 R12.1
$1N16894: length 14.5
  Top Layer w0.254: v1(41.79,56.3) 41.85,56.36 49.73,56.36 50.24,55.85 v1(50.24,54.58)
  Bottom Layer w0.254: R10.1 v1(41.79,56.3) 41.79,55.58 R11.2 ; 47.16,54.63 50.19,54.63 v1(50.24,54.58)
$1N17448: length 11.1
  Top Layer w0.254: R15.2 C38.1 24.77,26.2 25.34,26.77 U12.2
$1N17624: length 10.8
  Top Layer w0.254: 40.48,26.77 36.77,26.77 36.33,26.33 C39.1 R16.2
$1N17748: length 7
  Top Layer w0.254: U14.2 55.59,32.94 55.89,33.25 58.81,33.25 59.06,32.99 C40.1 R17.2
$1N17872: length 8.5
  Top Layer w0.254: U15.2 55.57,20.91 55.57,16.74 55.19,16.35 53.22,16.35 53.28,16.3 R18.2
$1N18088: length 4.3
  Bottom Layer w0.254: 62.67,57.78 R22.2 ; 66,57.74 66.06,57.81 66.06,58.43 65.76,58.74 62.67,58.74 ; R19.2 62.67,59.64
$1N18769: length 2.8
  Top Layer w0.254: LED1.2 R21.2
$1N32190: length 3
  Bottom Layer w0.254: C46.1 12.83,27.02 14.68,27.02 14.95,26.75 U18.8
$1N32192: length 3.8
  Bottom Layer w0.254: U18.6 11.12,24.79
$1N32929: length 15.8
  Top Layer w0.254: LED3.4 79.6,42.14 78.43,42.14 77.8,41.5 77.8,31.21 77.16,30.58 LED2.2
$1N36367: length 15.7
  Top Layer w0.254: LED3.2 76.52,39.08 77.29,39.85 77.29,50.01 77.86,50.58 LED4.4
$1N36433: length 15.6
  Top Layer w0.254: LED5.4 77.47,59.08 76.78,58.39 76.78,48.36 76,47.58 LED4.2
$1N36565: length 15.9
  Top Layer w0.254: LED6.2 4.92,58.93 4.39,58.39 4.39,47.98 3.75,47.34 2.73,47.34 LED7.4
$1N36631: length 15.9
  Top Layer w0.254: LED7.2 5.44,50.43 4.9,49.88 4.9,39.47 4.39,38.96 2.69,38.96 LED8.4
$1N36697: length 15.9
  Top Layer w0.254: LED9.4 2.75,30.32 4.64,30.32 5.41,31.09 5.41,41.37 5.96,41.93 LED8.2
$1N36771: length 99.3
  Top Layer w0.254: LED5.2 70.58,56.08 69.92,56.74 69.92,68.3 69.29,68.93 9.6,68.93 8.96,68.3 8.96,62.2 8.07,61.31 1.47,61.31 0.83,60.68 0.83,56.36 1.34,55.85 2.58,55.85 LED6.4

## Copper pours and planes (outline as drawn; the poured copper is in the pictures)
5V on Top Layer: 6.76,37.86 10.31,37.86 11.61,39.17 11.61,40.25 11.27,40.59 6.66,40.59 6.29,40.22 6.29,38.33
5V on Top Layer: 6.76,29.36 10.31,29.36 11.61,30.67 11.61,31.75 11.27,32.09 6.66,32.09 6.29,31.72 6.29,29.83
5V on Top Layer: 70.71,41.81 71.95,43.05 75.58,43.05 75.8,42.83 75.8,40.79 75.51,40.5 70.98,40.5 70.71,40.77
5V on Top Layer: 70.7,50.35 71.94,51.59 75.57,51.59 75.78,51.37 75.78,49.32 75.5,49.03 70.97,49.03 70.7,49.3
5V on Top Layer: 6.83,46.39 10.38,46.39 11.69,47.69 11.69,48.78 11.35,49.12 6.74,49.12 6.36,48.75 6.36,46.85
5V on Top Layer: 70.71,33.32 71.95,34.56 75.58,34.56 75.8,34.34 75.8,32.29 75.51,32 70.98,32 70.71,32.27
5V on Top Layer: 70.68,58.87 71.92,60.11 75.54,60.11 75.76,59.89 75.76,57.84 75.47,57.55 70.95,57.55 70.68,57.82
5V on Top Layer: 6.9,54.93 10.45,54.93 11.76,56.23 11.76,57.32 11.41,57.66 6.81,57.66 6.43,57.29 6.43,55.39
5V on Bottom Layer: 17.6,24.49 17.6,22.97 17.22,22.59 15.63,22.59 15.31,22.27 15.31,18.78 14.93,18.4 10.23,18.4 9.85,18.78 9.85,22.84 10.23,23.22 14.21,23.22 14.55,23.56 14.55,24.49
5V on PWR: 6.86,57.56 10.87,57.56 10.87,55.09 6.86,55.09
5V on PWR: 70.5,51.64 74.51,51.64 74.51,49.16 70.5,49.16
5V on PWR: 70.5,60.25 74.51,60.25 74.51,57.78 70.5,57.78
5V on PWR: 70.5,34.74 74.51,34.74 74.51,32.27 70.5,32.27
5V on PWR: 70.5,43.13 74.51,43.13 74.51,40.66 70.5,40.66
5V on PWR: 9.85,22.07 12.77,22.07 12.77,18.26 9.85,18.26
5V on PWR: 6.98,49 10.99,49 10.99,46.53 6.98,46.53
5V on PWR: 7.18,32.16 11.2,32.16 11.2,29.69 7.18,29.69
5V on PWR: 7.05,40.45 11.06,40.45 11.06,37.98 7.05,37.98
12.6V on Bottom Layer: 45.03,28.55 45.03,24.61 44.65,24.23 37.68,24.23 37.03,24.88 37.03,28.29 37.28,28.55
12.6V on Bottom Layer: 26.37,24.48 29.79,24.48 29.92,24.61 29.92,29.56 29.54,29.94 3.37,29.94 2.99,29.56 2.99,18.77 3.37,18.39 10.59,18.39 15.44,23.23 25.12,23.23
12.6V on Bottom Layer: 48.82,28.59 48.82,24.84 48.2,24.23 44.39,24.23 44.39,28.15 44.8,28.59
12.6V on Bottom Layer: 38.43,28.55 38.43,24.61 38.17,24.36 30.55,24.36 29.79,25.12 29.79,29.56 29.41,29.94 30.74,29.94 32.2,28.48 38.36,28.48
12.6V_IN on PWR: 45.98,12.36 44.39,13.94 11.76,13.94 9.85,15.85 9.85,21.31 8.33,22.83 -0.82,22.83 -0.94,22.7 -0.94,1.37 1.34,-0.92 45.54,-0.92 45.98,-0.48
GND on Top Layer: -9.45,76.81 88.59,76.81 88.59,-8.03 -9.45,-8.03
GND on Bottom Layer: 19.88,27.47 24.64,27.47 24.64,22.7 19.88,22.7
GND on Bottom Layer: -8.18,73.63 89.48,73.63 89.48,-4.47 -8.18,-4.47
GND on Bottom Layer: 44.39,59.28 50.74,59.28 50.74,57.88 44.39,57.88
GND on Bottom Layer: 26.74,26.26 26.74,25.12 26.87,24.99 29.54,24.99 29.92,24.61 29.92,18.75 29.54,18.38 24.56,18.38 24.56,25.6 25.22,26.26
GND on Bottom Layer: 9.72,27.47 14.48,27.47 14.48,22.7 9.72,22.7
GND on Bottom Layer: 36.39,21.31 45.79,21.31 45.79,14.73 36.39,14.73
GND on Bottom Layer: 18.49,19.64 20.46,19.64 20.46,18.39 18.49,18.39
GND on Bottom Layer: 16.71,26.26 16.71,25.12 16.84,24.99 19.38,24.99 19.76,24.61 19.76,18.75 19.38,18.38 14.53,18.38 14.53,25.6 15.19,26.26
GND on GND: 0.26,69.74 82,69.74 82,0.26 0.26,0.26
VDD on Bottom Layer: 44.52,60.68 49.86,60.68 49.86,59.41 44.52,59.41
VDD on Bottom Layer: 27.63,24.36 27.63,22.96 27.25,22.58 25.66,22.58 25.34,22.26 25.34,18.77 24.96,18.39 20.27,18.39 19.88,18.77 19.88,22.83 20.27,23.21 24.25,23.21 24.58,23.55 24.58,24.36
VDD on Bottom Layer: 56.21,23.52 56.21,23.09 54.02,23.09 53.79,22.85 53.79,21.86 53.54,21.61 52.64,21.61 52.4,21.86 52.4,24.61 52.6,24.81 53.59,24.81 53.79,24.61 53.79,23.77 54.03,23.52
VDD on Bottom Layer: 47.7,36.96 49.56,36.96 49.56,36.04 47.7,36.04
VDD on Bottom Layer: 41.22,29.56 42.24,29.56 42.24,26.2 41.22,26.2
VDD on Bottom Layer: 24.58,39.47 24.58,37.18 24.08,36.67 22.42,36.67 22.42,39.45 22.44,39.47
VDD on PWR: -5.26,73.25 85.8,73.25 85.8,-3.33 -5.26,-3.33
AO1 on Bottom Layer: 43.76,21.5 44.95,21.5 44.95,19.02 43.76,19.02
AO2 on Bottom Layer: 41.15,21.34 42.35,21.34 42.35,19.12 41.15,19.12
BO1 on Bottom Layer: 37.27,21.37 38.41,21.37 38.41,19.1 37.27,19.1
BO2 on Bottom Layer: 39.88,21.35 41.03,21.35 41.03,19.11 39.88,19.11
$1N2951 on Bottom Layer: 20.77,25.92 21.77,25.92 21.77,23.59 20.77,23.59
$1N18033 on Bottom Layer: 77.54,60.97 77.54,55.98 77.03,55.47 67.76,55.47 67.26,55.98 67.26,60.93 67.76,61.44 77.07,61.44
$1N18088 on Bottom Layer: 62.2,60.2 63.16,60.2 63.16,57.27 62.2,57.27
$1N32192 on Bottom Layer: 10.63,25.92 11.57,25.92 11.57,23.51 10.63,23.51

Small or netless copper shapes (teardrops, artwork), in the pictures only: 99 on Top Layer, 206 on Bottom Layer

## Text on the board
Top Silkscreen Layer: (Y) | (N) | DOWN | UP | 惯导小车  V1.0 | Mr_Pian
